# EAGLE design XBee-Adapter_v11 (EAGLE 7.7.0)
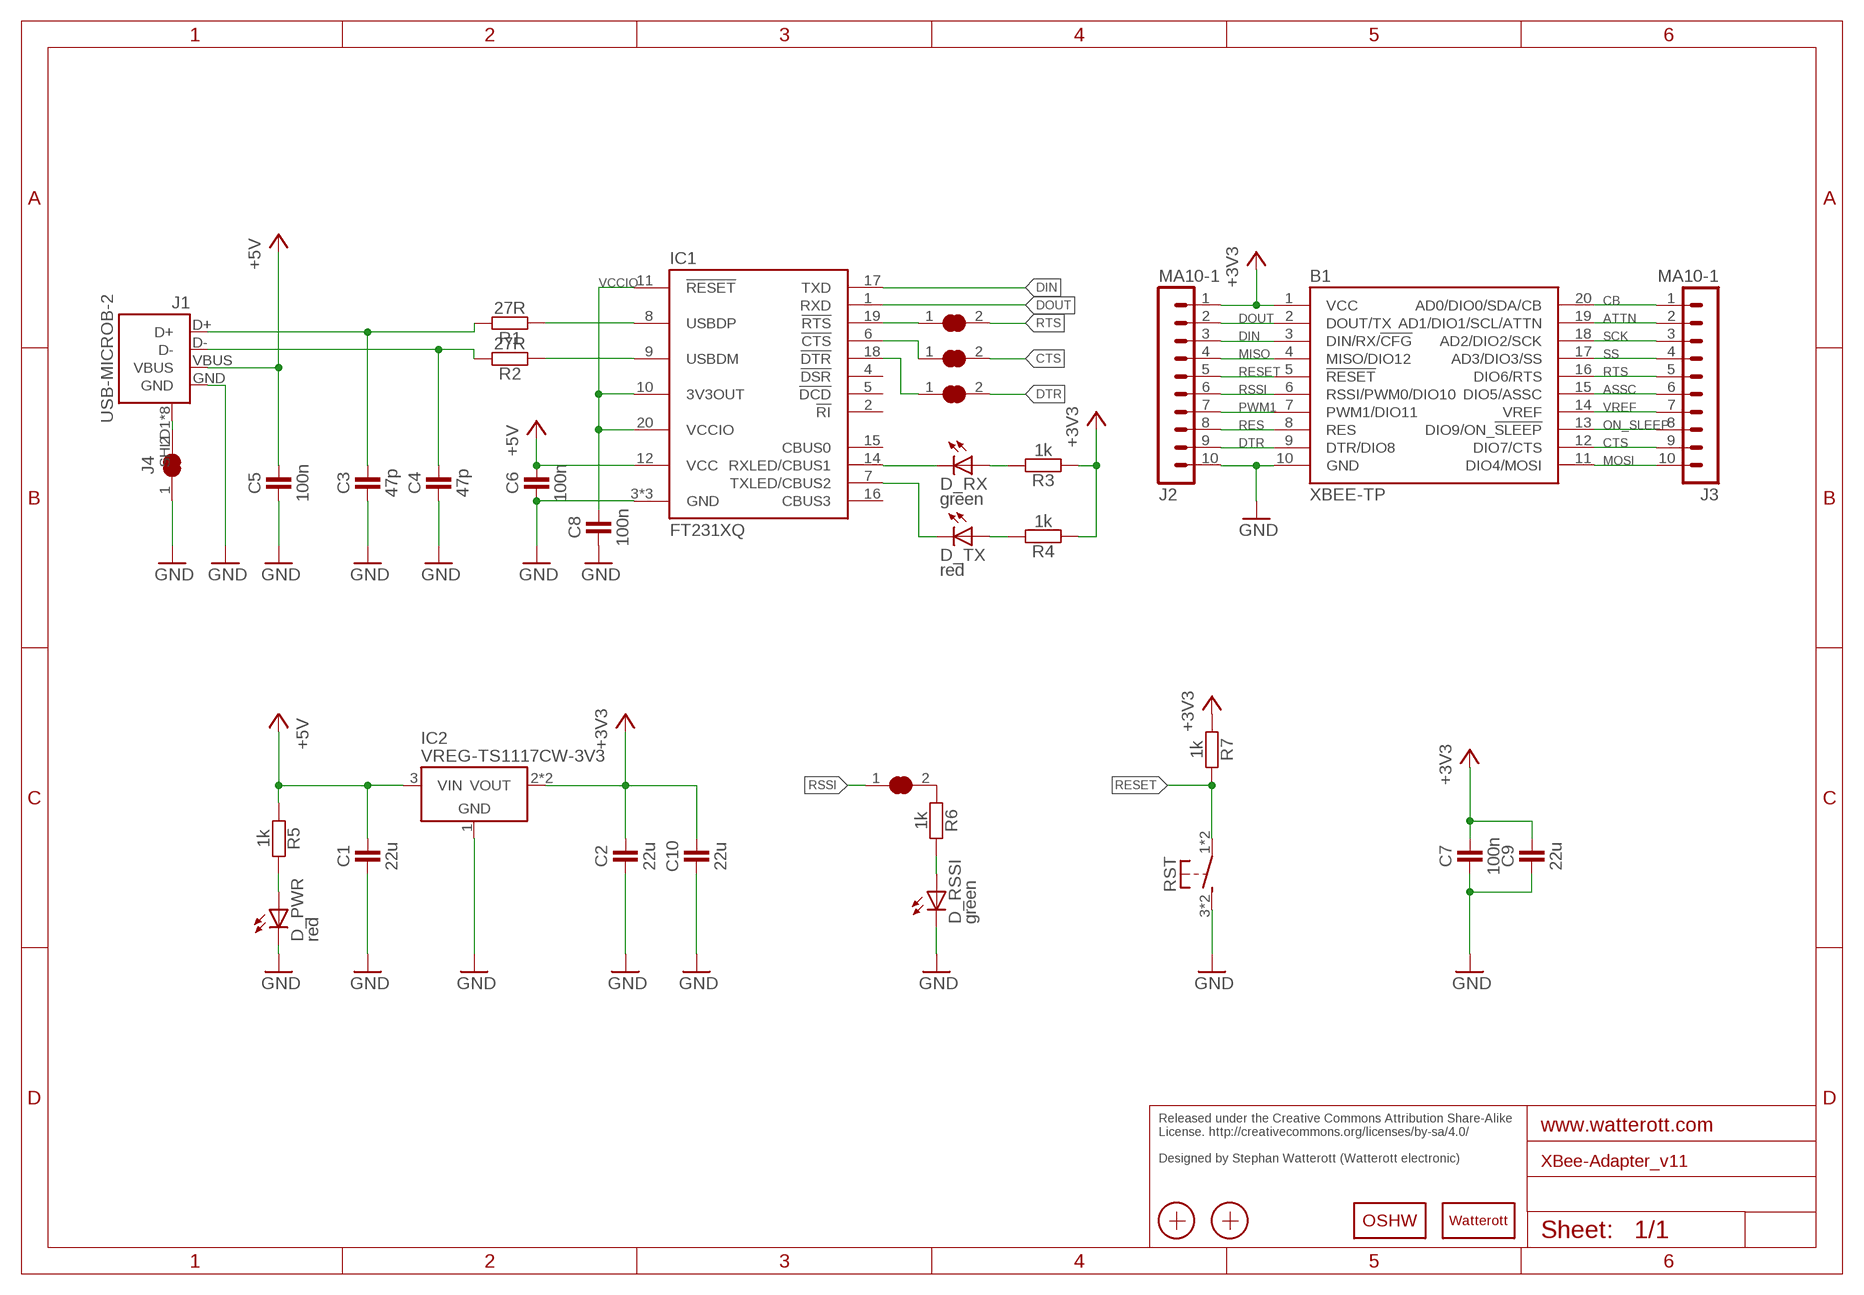
[diagram p0: schematic, sheet 1]

## Parts
B1  XBEE-TP  [XBEE_TP]
C1  22u  CAPACITOR-0805  [C0805]
C2  22u  CAPACITOR-0805  [C0805]
C3  47p  CAPACITOR-0402  [C0402]
C4  47p  CAPACITOR-0402  [C0402]
C5  100n  CAPACITOR-0402  [C0402]
C6  100n  CAPACITOR-0402  [C0402]
C7  100n  CAPACITOR-0402  [C0402]
C8  100n  CAPACITOR-0402  [C0402]
C9  22u  CAPACITOR-0805  [C0805]
C10  22u  CAPACITOR-0805  [C0805]
CTS  JUMPER2-0603  [JUMPER2-0603]
D_PWR  red  LED-0603  [C0603]
D_RSSI  green  LED-0603  [C0603]
D_RX  green  LED-0603  [C0603]
D_TX  red  LED-0603  [C0603]
DTR  JUMPER2-0603  [JUMPER2-0603]
IC1  FT231XQ  [QFN20-PAD]
IC2  VREG-TS1117CW-3V3  [SOT223]
J1  USB-MICROB-2  [USB-MICROB-10118194]
J2  MA10-1  [MA10-1]
J3  MA10-1  [MA10-1]
J4  JUMPER2-0603  [JUMPER2-0603]
LOGO1  OSHW_LOGOX0150  [OSHW_6X150]
LOGO2  LOGO-S_PLACE_M  [SPARK_TPLACE_M]
R1  27R  RESISTOR-0603  [C0603]
R2  27R  RESISTOR-0603  [C0603]
R3  1k  RESISTOR-0402  [C0402]
R4  1k  RESISTOR-0402  [C0402]
R5  1k  RESISTOR-0402  [C0402]
R6  1k  RESISTOR-0402  [C0402]
R7  1k  RESISTOR-0402  [C0402]
RSSI  JUMPER2-0603  [JUMPER2-0603]
RST  SW-TACTILE-PTS840P  [PTS840P]
RTS  JUMPER2-0603  [JUMPER2-0603]
X1  PASSER-07  [PASSER_07MM]
X2  PASSER-07  [PASSER_07MM]

## Nets
+3V3: B1.1(VCC) C2.2 C7.2 C9.2 C10.2 IC2.2(VOUT) IC2.4(VOUT) J2.1 R3.1 R4.1 R7.1
+5V: C1.2 C5.2 C6.2 IC1.12(VCC) IC2.3(VIN) J1.VBUS R5.1
ASSC: B1.15(DIO5/ASSC) J3.6
ATTN: B1.19(AD1/DIO1/SCL/ATTN) J3.2
CB: B1.20(AD0/DIO0/SDA/CB) J3.1
CTS: B1.12(DIO7/CTS) CTS.2 J3.9
D_N: C4.2 J1.D- R2.2
D_P: C3.2 J1.D+ R1.2
DIN: B1.3(DIN/RX/!CFG!) IC1.17(TXD) J2.3
DOUT: B1.2(DOUT/TX) IC1.1(RXD) J2.2
DTR: B1.9(DTR/DIO8) DTR.2 J2.9
GND: B1.10(GND) C1.1 C2.1 C3.1 C4.1 C5.1 C6.1 C7.1 C8.1 C9.1 C10.1 D_PWR.C D_RSSI.C IC1.3(GND) IC1.13(GND) IC1.TP(GND) IC2.1(GND) J1.GND J2.10 J4.1 RST.3(S1) RST.4(S1)
MISO: B1.4(MISO/DIO12) J2.4
MOSI: B1.11(DIO4/MOSI) J3.10
N$1: D_PWR.A R5.2
N$2: D_RSSI.A R6.2
N$3: R6.1 RSSI.2
N$6: J1.SHLD1(SHIELD) J1.SHLD2(SHIELD) J1.SHLD3(SHIELD) J1.SHLD4(SHIELD) J1.SHLD5(SHIELD) J1.SHLD6(SHIELD) J1.SHLD7(SHIELD) J1.SHLD8(SHIELD) J4.2
N$8: IC1.19(!RTS) RTS.1
N$10: CTS.1 IC1.6(!CTS)
N$11: D_RX.C IC1.14(RXLED/CBUS1)
N$12: D_TX.C IC1.7(TXLED/CBUS2)
N$13: D_RX.A R3.2
N$14: D_TX.A R4.2
N$15: DTR.1 IC1.18(!DTR)
ON_SLEEP: B1.13(DIO9/ON_!SLEEP!) J3.8
PWM1: B1.7(PWM1/DIO11) J2.7
RES: B1.8(RES) J2.8
RESET: B1.5(!RESET!) J2.5 R7.2 RST.1 RST.2(P1)
RSSI: B1.6(RSSI/PWM0/DIO10) J2.6 RSSI.1
RTS: B1.16(DIO6/RTS) J3.5 RTS.2
SCK: B1.18(AD2/DIO2/SCK) J3.3
SS: B1.17(AD3/DIO3/SS) J3.4
USB_N: IC1.9(USBDM) R2.1
USB_P: IC1.8(USBDP) R1.1
VCCIO: C8.2 IC1.10(3V3OUT) IC1.11(!RESET) IC1.20(VCCIO)
VREF: B1.14(VREF) J3.7
Unconnected: IC1.2(!RI) IC1.4(!DSR) IC1.5(!DCD) IC1.15(CBUS0) IC1.16(CBUS3)

## Notes on the sheet
- Released under the Creative Commons Attribution Share-Alike 
  License. http://creativecommons.org/licenses/by-sa/4.0/
  
  Designed by Stephan Watterott (Watterott electronic)

## Library data of the parts
B1 = we-board:XBEE: XBEE connector
C1-C10 = we-rcl:CAPACITOR: Capacitors ...2.2uF @ 6.3V -> 0402 ...4.7uF @ 6.3V -> 0603 ...10uF @ 16V -> 0805 ...22uF @ 25V -> 1206
CTS DTR J4 RSSI RTS = we-rcl:JUMPER2: 2 Pin Jumpers
D_PWR D_RSSI D_RX D_TX = we-opto:LED: LEDs red, green, blue -> 0603
IC1 = we-chip:FT231X: FTDI FT231X USB to UART Bridge (5V tolerant inputs); DIGIKEY: 768-1128-6-ND
IC2 = we-power:VREG: Voltage Regulators (LDOs, Switching Converters...) LDOs Taiwan Semi TS1117 800mA max 15V - compatible On Semi NCP1117 1A max 20V - compatible Diodes AP2111H 0.6A max 6V (0.25V@0.6A) - compatible Diodes AP2114H 1A max 6V (0.45V@1A) Taiwan Semi TS9011 250mA max 12V - compatible Diodes AP2210 300mA max 15V - compatible Microchip MCP1700 250mA max 6.5V - compatible Microchip MCP1702 250mA max 13V - compatible Microchip MCP1703 250mA max 16V - compatible Microchip MCP1754 150mA max 16V Taiwan Semi TS5204 150mA max 16V (low noise) DC/DC Converter Modules Recom R-78Ex.x-1.0-W36 1A max 28V - compatible CUI V78xx-2000 2A max 18V Murata OKI-78SR-x.x/1.5-W36 1.5A max 36V
J1 = we-con:USB: USB Connectors; DIGIKEY: 609-4618-6-ND
J2 J3 = we-con:MA10-1: Pin Header
LOGO1 = we-symbol:OSHW_LOGO: Open-Source-Hardware Logo
LOGO2 = we-symbol:LOGO: Watterott electronic Logo
R1-R7 = we-rcl:RESISTOR: Resistors all kinds in 0402 and 0603
RST = we-switch:SW-TACTILE: Tactile Switches; DIGIKEY: CKN10511DKR-ND
X1 X2 = we-symbol:PASSER: Fiducial Markers

## Board
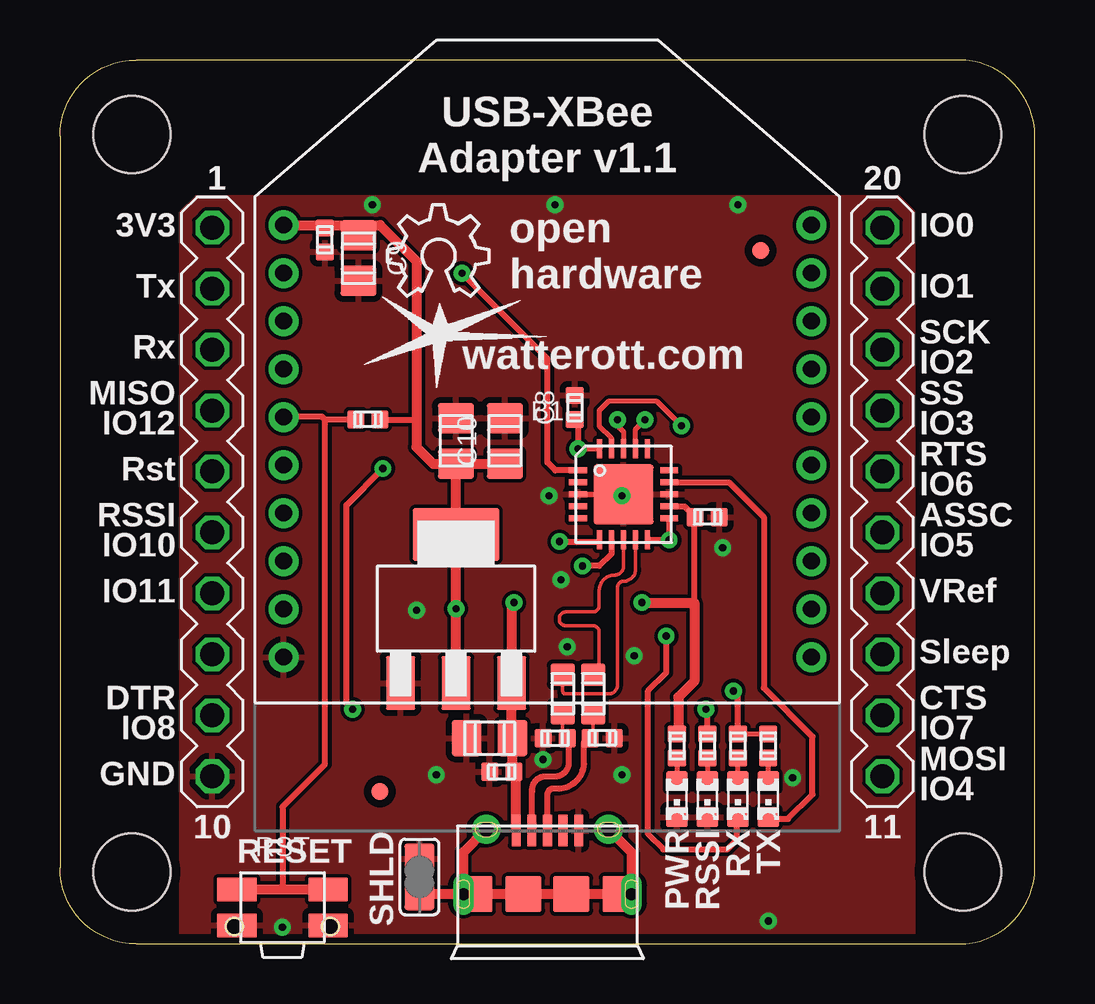
[diagram p1: board, top side]
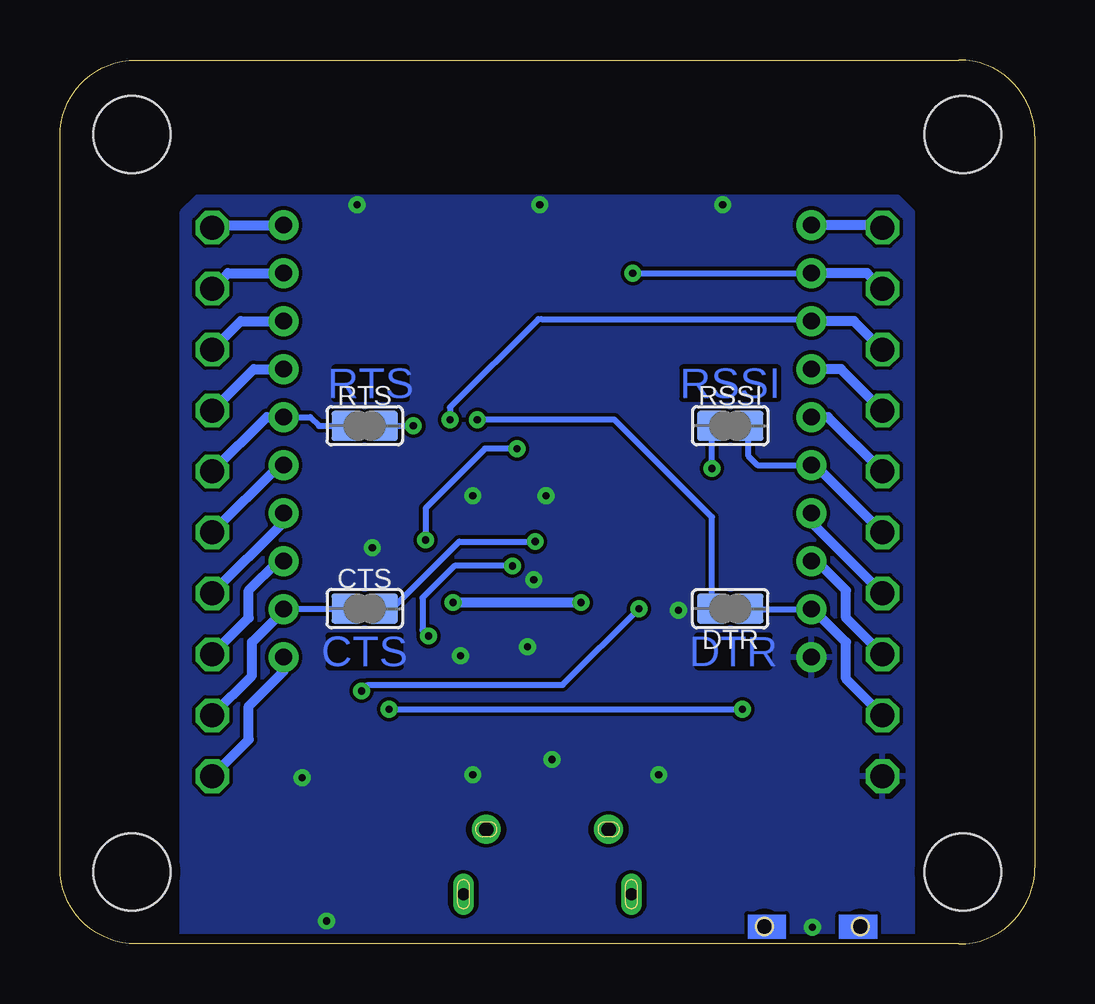
[diagram p2: board, bottom side, seen from below]

Size 40.64 x 36.83 mm. Coordinates in mm from the lower left corner, seen from the top.
Outline: 3.17,0 arc-90 0,3.17 0,33.66 arc-90 3.17,36.83 37.46,36.83 arc-90 40.64,33.66 40.64,3.17 arc-90 37.46,0 3.17,0
Copper layers (1*16): Top 0.035mm / dielectric 1.5mm / Bottom 0.035mm
Design rules "we-dru-2-layer": minimum track width 0.15mm, minimum drill 0.3mm, track to track 0.15mm, track to pad 0.15mm, pad to pad 0.15mm, via to via 0.15mm, smd to smd 0.1mm, copper to edge 0.4mm, drill to drill 0.2mm, minimum pad ring 0.18mm, minimum via ring 0.2mm, stop-mask expansion 0.1mm, vias tented up to drill 0.5mm, thermal gap 0.25mm
Holes 3.2 mm at 3,3 3,33.73 37.64,33.73 37.64,3

### Footprints (pad centres in the part's own frame; a part is rotated, then mirrored left to right if it is on the bottom)
XBEE_TP = drill 0.7 pad 1.25: 1 -11,9; 2 -11,7; 3 -11,5; 4 -11,3; 5 -11,1; 6 -11,-1; 7 -11,-3; 8 -11,-5; 9 -11,-7; 10 -11,-9; 11 11,-9; 12 11,-7; 13 11,-5; 14 11,-3; 15 11,-1; 16 11,1; 17 11,3; 18 11,5; 19 11,7; 20 11,9
C0805 = smd 1.5 x 1.25: 1 0,0.95; 2 0,-0.95
C0402 = smd 0.75 x 0.7: 1 0,0.5; 2 0,-0.5
JUMPER2-0603 = smd 1.25 x 1.25: 1 0,0.76; 2 0,-0.76
C0603 = smd 0.9 x 0.8: A 0,-0.75; C 0,0.75
QFN20-PAD = smd 0.8 x 0.26: 1 -1.9,1; 2 -1.9,0.5; 3 -1.9,0; 4 -1.9,-0.5; 5 -1.9,-1; 11 1.9,-1; 12 1.9,-0.5; 13 1.9,0; 14 1.9,0.5; 15 1.9,1 | smd 0.26 x 0.8: 6 -1,-1.9; 7 -0.5,-1.9; 8 0,-1.9; 9 0.5,-1.9; 10 1,-1.9; 16 1,1.9; 17 0.5,1.9; 18 0,1.9; 19 -0.5,1.9; 20 -1,1.9 | smd 2.5 x 2.5: TP 0,0
SOT223 = smd 2.235 x 1.219: 1 -3.099,2.311; 2 -3.099,0; 3 -3.099,-2.311 | smd 2.2 x 3.6: 4 3.099,0
USB-MICROB-10118194 = smd 1.3 x 0.4: D+ -2.5,0; D- -2.5,-0.65; GND -2.5,1.3; ID -2.5,0.65; VBUS -2.5,-1.3 | drill 0.6 pad 1.2: SHLD1 -2.55,2.55; SHLD2 -2.55,-2.55 | drill 0.5 pad 0.8 long: SHLD3 0.15,3.5; SHLD4 0.15,-3.5 | smd 1.5 x 1.1: SHLD5 0.15,2.85; SHLD6 0.15,-2.85 | smd 1.5 x 1.5: SHLD7 0.15,1; SHLD8 0.15,-1
MA10-1 = drill 1 octagon: 1 0,11.43; 2 0,8.89; 3 0,6.35; 4 0,3.81; 5 0,1.27; 6 0,-1.27; 7 0,-3.81; 8 0,-6.35; 9 0,-8.89; 10 0,-11.43
C0603' = smd 1 x 0.95: 1 0,0.8; 2 0,-0.8
PTS840P = smd 1.65 x 1: 1 -1.9,0.75; 2 1.9,0.75; 3 -1.9,-0.75; 4 1.9,-0.75 | hole 0.7: -2,-0.8; 2,-0.8
PASSER_07MM = smd 0.7 x 0.7: X 0,0

### Placement (x,y rotation side)
B1  20.32,20.95 0 top
C1  17.91,8.57 90 top
C2  16.51,20.95 0 top
C3  22.61,8.57 270 top
C4  20.64,8.57 90 top
C5  18.41,7.18 90 top
C6  26.99,17.78 270 top
C7  11.05,29.34 180 top
C8  21.46,22.35 0 top
C9  12.45,28.57 180 top
C10  18.54,20.95 0 top
CTS  27.94,13.97 270 bottom
D_PWR  25.72,6.03 180 top
D_RSSI  26.99,6.03 180 top
D_RX  29.53,6.03 180 top
D_TX  28.26,6.03 180 top
DTR  12.7,13.97 90 bottom
IC1  23.49,18.73 0 top
IC2  16.51,13.97 90 top
J1  20.32,2.22 270 top
J2  6.35,18.41 0 top
J3  34.29,18.41 0 top
J4  14.99,2.79 0 top
LOGO1  13.65,26.99 0 top
LOGO2  15.88,25.4 0 top
R1  27R  [C0603']  22.23,10.41 0 top
R2  27R  [C0603']  20.95,10.41 0 top
R3  29.53,8.26 0 top
R4  28.26,8.26 0 top
R5  25.72,8.26 0 top
R6  26.99,8.26 0 top
R7  12.83,21.84 270 top
RSSI  12.7,21.59 270 bottom
RST  9.27,1.52 0 top
RTS  27.94,21.59 270 bottom
X1  13.34,6.35 0 top
X2  29.21,28.89 0 top

### Tracks (layer width: path | path; a pad name or v marks a point on that pad's centre or on a via)
+3V3  (via drill 0.3)
  Top 0.2: R4.1 R3.1
  Top 0.254: R4.1 28.26,10.35 v28.07,10.54 | R7.1 14.86,21.84
  Top 0.406: IC2.2 v16.51,13.97 IC2.4 C2.2 | C2.2 15.55,20 14.86,20.7 14.86,21.84 14.86,28.45 13.35,29.95 12.45,29.95 | B1.1 11.05,29.95 | 11.05,29.95 12.45,29.95 | C9.2 12.45,29.95 | C7.2 11.05,29.95 | C2.2 C10.2
  Bottom 0.254: v28.07,10.54 27.81,10.79 19.69,10.79 v16.51,13.97
  Bottom 0.406: J2.1 6.46,29.95 B1.1
+5V  (via drill 0.3)
  Top 0.254: IC1.12 26.03,18.23 C6.2 26.44,17.73 26.44,14.22 | 25.78,8.87 25.78,8.82 R5.1 | 19.02,7.12 18.97,7.12 C5.2
  Top 0.406: J1.VBUS 19.02,7.12 | 25.78,8.87 25.78,10.29 26.44,10.94 26.44,14.22 v24.26,14.22 | v18.92,14.22 18.82,14.12 IC2.3 18.82,8.57 C1.2 18.86,7.18 C5.2
  Bottom 0.406: v18.92,14.22 v24.26,14.22
ASSC
  Bottom 0.406: J3.6 31.48,19.95 B1.15
ATTN
  Bottom 0.406: J3.2 33.64,27.95 B1.19
CB
  Bottom 0.406: J3.1 34.18,29.95 B1.20
CTS
  Bottom 0.254: CTS.2 28.72,13.96 B1.12
  Bottom 0.406: J3.9 32.64,11.18 32.64,12.57 31.32,13.89 B1.12
D_N
  Top 0.15: C4.2 arc-90 20.95,8.76 R2.2
  Top 0.254: J1.D- arc90 19.69,5.12 19.69,6.35 arc-90 20.19,6.99 20.57,6.99 arc90 21.21,7.49 21.21,8.55 arc90 C4.2 | 21.19,9.7 arc90 R2.2
D_P
  Top 0.15: C3.2 arc90 22.23,8.69 R1.2
  Top 0.254: J1.D+ 20.32,6.22 arc-90 20.57,6.48 20.7,6.48 arc90 21.84,7.49 21.84,8.36 arc-90 C3.2 | 22.06,9.7 arc-90 R1.2
DIN  (via drill 0.3)
  Top 0.2: IC1.17 23.99,21.45 v24.38,21.84
  Bottom 0.2: 20.57,26.04 20.7,26.04
  Bottom 0.254: 20.57,26.04 9.4,26.04 B1.3 | 20.7,26.04 24.38,22.35 v24.38,21.84
  Bottom 0.406: J2.3 7.54,25.95 B1.3
DOUT  (via drill 0.3)
  Top 0.254: v16.76,27.94 20.32,24.38 20.32,20.07 20.65,19.73 IC1.1
  Bottom 0.254: v16.76,27.94 9.34,27.94 B1.2
  Bottom 0.406: J2.2 7,27.95 B1.2
DTR
  Bottom 0.2: DTR.2 13.59,13.97
  Bottom 0.254: DTR.2 11.93,13.96 11.81,13.96 | 11.81,13.96 B1.9 | DTR.2 11.81,13.97 11.81,13.96
  Bottom 0.406: J2.9 7.87,11.05 7.87,12.57 9.26,13.96 B1.9
GND  (via drill 0.3)
  Top 0.2: IC1.3 IC1.TP
  other vias: 27.62,16.51 13.02,30.8 28.26,30.8 9.27,0.7 29.53,0.95 20.64,30.8 23.94,12 14.86,13.91 23.43,7.05 20.13,7.68 21.15,12.38 20.38,18.67 15.68,7.05 30.54,6.92 23.43,18.67 20.89,15.18
  pour Top: 5.08,0 5.08,30.48 5.71,31.11 34.92,31.11 35.56,30.48 35.56,0
  pour Bottom: 5.71,31.11 34.92,31.11 35.56,30.48 35.56,0 5.08,0 5.08,30.48
MISO
  Bottom 0.406: J2.4 8.08,23.95 B1.4
MOSI
  Bottom 0.406: J3.10 32.77,8.51 32.77,9.91 31.32,11.35 B1.11
N$1
  Top 0.2: R5.2 D_PWR.A
N$2
  Top 0.2: R6.2 D_RSSI.A
N$3  (via drill 0.3)
  Top 0.254: R6.1 26.99,9.72 v26.92,9.78 | v12.19,9.78 11.94,10.03 11.94,18.29 v13.46,19.81
  Bottom 0.2: RSSI.2
  Bottom 0.254: v26.92,9.78 v12.19,9.78 | v13.46,19.81 RSSI.2
N$6
  Top 0.2: J1.SHLD6 J1.SHLD4
  Top 0.406: J1.SHLD1 23.82,3.82 J1.SHLD3 J1.SHLD5 J1.SHLD7 J1.SHLD8 J1.SHLD6 | J1.SHLD2 16.82,3.82 J1.SHLD4 15.02,2.07 J4.2
N$8  (via drill 0.3)
  Top 0.2: v25.91,21.59 24.89,22.61 22.86,22.61 22.48,22.23 22.48,21.59 22.99,21.08 IC1.19
  Bottom 0.254: RTS.1 v25.91,21.59
N$9
  Top 0.2: 14.99,3.43 14.99,2.16
N$10  (via drill 0.3)
  Top 0.2: 22.43,16.76 IC1.6
  Top 0.254: v20.83,16.76 22.43,16.76
  Bottom 0.2: 26.8,13.97 CTS.1 28.7,13.97
  Bottom 0.254: 26.8,13.97 24,16.76 v20.83,16.76
N$11
  Top 0.2: D_RX.C 29.6,5.21
  Top 0.254: IC1.14 27.88,19.23 29.34,17.78 29.34,10.67 31.37,8.64 31.37,6.22 30.35,5.21 29.6,5.21
N$12  (via drill 0.3)
  Top 0.2: D_TX.C 28.19,5.22
  Top 0.254: IC1.7 22.99,16.26 22.48,15.75 v21.78,15.75 | 28.19,5.22 28.19,4.32 27.81,3.94 25.15,3.94 24.51,4.57 24.51,10.54 25.27,11.3 v25.27,12.83
  Bottom 0.254: v21.78,15.75 24.19,15.75 25.53,14.41 25.53,13.08 v25.27,12.83
N$13
  Top 0.2: D_RX.A R3.2
N$14
  Top 0.2: D_TX.A R4.2
N$15  (via drill 0.3)
  Top 0.2: v23.24,21.84 23.24,21.59 23.49,21.34 IC1.18
  Bottom 0.254: DTR.1 13.46,17.78 17.53,21.84 v23.24,21.84
ON_SLEEP
  Bottom 0.406: J3.8 32.77,13.59 32.77,14.73 31.54,15.96 B1.13
PWM1
  Bottom 0.406: J2.7 9.32,17.57 B1.7
RES
  Bottom 0.406: J2.8 7.87,13.59 7.87,14.73 9.1,15.96 B1.8
RESET
  Top 0.254: 11.05,21.84 11.05,7.49 9.27,5.71 9.27,2.27 | 11.05,21.84 10.92,21.97 9.34,21.97 B1.5 | R7.2 11.05,21.84
  Top 0.406: RST.1 9.27,2.27 RST.2
  Bottom 0.406: J2.5 8.62,21.95 B1.5
RSSI
  Bottom 0.2: RSSI.1 | 12.07,21.59 13.59,21.59
  Bottom 0.254: B1.6 11.57,19.95 11.94,20.32 RSSI.1 12.07,21.59
  Bottom 0.406: J2.6 9.16,19.95 B1.6
RST
  Bottom 0.2: 27.3,21.59 28.83,21.59
RTS
  Bottom 0.254: B1.16 30.21,21.95 29.84,21.59 RTS.2
  Bottom 0.406: J3.5 32.02,21.95 B1.16
SCK
  Bottom 0.406: J3.3 33.1,25.95 B1.18
SS
  Bottom 0.406: J3.4 32.56,23.95 B1.17
USB_N
  Top 0.152: R2.1 20.95,10.54 arc90 21.08,10.41 22.86,10.41 arc90 23.24,10.79 23.24,14.86 arc-90 23.49,15.11 arc90 23.99,15.61 IC1.9
USB_P
  Top 0.152: R1.1 arc90 22.48,11.22 22.48,12.99 arc90 22.21,13.26 21.08,13.26 arc-90 20.81,13.53 20.81,13.56 arc-90 21.08,13.83 22.21,13.83 arc90 22.48,14.1 22.48,14.73 arc-90 23.11,15.37 arc90 23.49,15.75 IC1.8
VCCIO  (via drill 0.3)
  Top 0.2: v21.59,20.63 v21.59,20.64 | IC1.11 | v25.4,16.83
  Top 0.254: IC1.20 v21.59,20.63 | v25.4,16.83 IC1.11 | IC1.10 v25.4,16.83 | C8.2 21.59,21.85 v21.59,20.64
  Bottom 0.254: v21.59,20.64 22.92,20.64 25.4,18.16 v25.4,16.83
VREF
  Bottom 0.406: J3.7 31.32,17.57 B1.14

### Text on the board
Bottom: RSSI | RTS | DTR | CTS
tPlace: USB-XBee / Adapter v1.1 | 1 | 20 | 3V3 | IO0 | open / hardware | Tx | IO1 | Rx | watterott.com | SCK / IO2 | MISO / IO12 | SS / IO3 | Rst | RTS / IO6 | RSSI / IO10 | ASSC / IO5 | IO11 | VRef | Sleep | DTR / IO8 | CTS / IO7 | GND | MOSI / IO4 | 10 | SHLD | PWR | RSSI | RX | TX | 11 | RESET
Reference: Silkscreen: 21 tPlace